# Altium schematic sheet sch.SchDoc
size A4
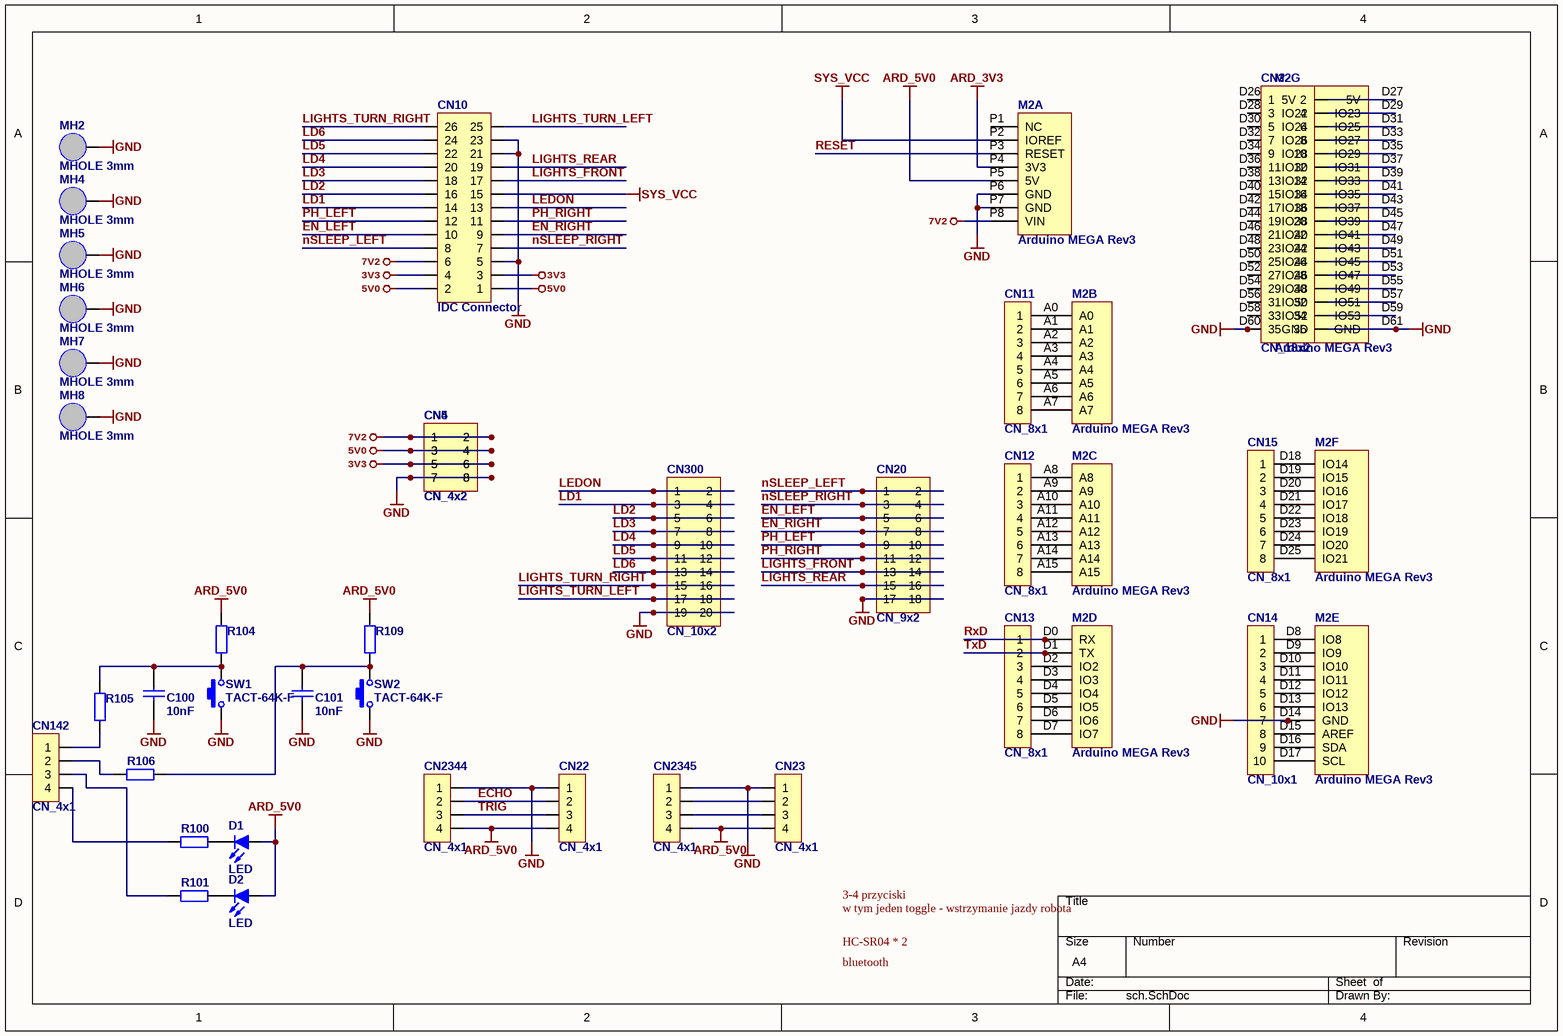
[diagram p0: sch.SchDoc]

## Parts
C100  10nF  [C0805]
C101  10nF  [C0805]
CN4  CN_4x2  [GP_4x2]
CN5  CN_4x2  [GP_4x2]
CN10  IDC Connector  [IDC26_RA]
CN11  CN_8x1  [GP_8x1]
CN12  CN_8x1  [GP_8x1]
CN13  CN_8x1  [GP_8x1]
CN14  CN_10x1  [GP_10x1]
CN15  CN_8x1  [GP_8x1]
CN20  CN_9x2  [GP_9x2]
CN22  CN_4x1  [GP_4x1H_F]
CN23  CN_4x1  [GP_4x1H_F]
CN142  CN_4x1  [GP_4x1]
CN300  CN_10x2  [GP_10x2]
CN2344  CN_4x1  [GP_4x1]
CN2345  CN_4x1  [GP_4x1]
CN?  CN_18x2  [GP_18x2]
D1  LED  [LED-Polarized - 3mm]
D2  LED  [LED-Polarized - 3mm]
M2  Arduino MEGA Rev3  [Arduino_MEGA_UPSIDE_DOWN]  (parts A,B,C,D,E,F,G of 7)
MH2  MHOLE 3mm  [3mm screw drill I]  (no BOM)
MH4  MHOLE 3mm  [3mm screw drill I]  (no BOM)
MH5  MHOLE 3mm  [3mm screw drill I]  (no BOM)
MH6  MHOLE 3mm  [3mm screw drill I]  (no BOM)
MH7  MHOLE 3mm  [3mm screw drill I]  (no BOM)
MH8  MHOLE 3mm  [3mm screw drill I]  (no BOM)
R100  (no value)  [R0805]
R101  (no value)  [R0805]
R104  (no value)  [R0805]
R105  (no value)  [R0805]
R106  (no value)  [R0805]
R109  (no value)  [R0805]
SW1  TACT-64K-F  [TACT-64K-F]
SW2  TACT-64K-F  [TACT-64K-F]

## Nets
3V3: CN4.5 CN4.6 CN5.5 CN5.6 CN10.3 CN10.4
5V0: CN4.3 CN4.4 CN5.3 CN5.4 CN10.1 CN10.2
7V2: CN4.1 CN4.2 CN5.1 CN5.2 CN10.6 M2.P8(VIN)
ARD_3V3: M2.P4(3V3)
ARD_5V0: CN22.4 CN23.4 CN2344.4 CN2345.4 D1.1(A) D2.1(A) M2.P5(5V) R104.2 R109.2
GND: C100.1 C101.1 CN4.7 CN4.8 CN5.7 CN5.8 CN10.5 CN10.21 CN10.23 CN14.7 CN20.17 CN20.18 CN22.1 CN23.1 CN300.19 CN300.20 CN2344.1 CN2345.1 CN?.35 CN?.36 M2.D14(GND) M2.D60(GND) M2.D61(GND) M2.P6(GND) M2.P7(GND) MH2.1(GND) MH4.1(GND) MH5.1(GND) MH6.1(GND) MH7.1(GND) MH8.1(GND) SW1.1 SW2.1
SYS_VCC: CN10.15 M2.P2(IOREF)
ECHO: CN22.2 CN2344.2
EN_LEFT: CN10.10 CN20.5 CN20.6
EN_RIGHT: CN10.9 CN20.7 CN20.8
LD1: CN10.14 CN300.3 CN300.4
LD2: CN10.16 CN300.5 CN300.6
LD3: CN10.18 CN300.7 CN300.8
LD4: CN10.20 CN300.9 CN300.10
LD5: CN10.22 CN300.11 CN300.12
LD6: CN10.24 CN300.13 CN300.14
LEDON: CN10.13 CN300.1 CN300.2
LIGHTS_FRONT: CN10.17 CN20.13 CN20.14
LIGHTS_REAR: CN10.19 CN20.15 CN20.16
LIGHTS_TURN_LEFT: CN10.25 CN300.17 CN300.18
LIGHTS_TURN_RIGHT: CN10.26 CN300.15 CN300.16
nSLEEP_LEFT: CN10.8 CN20.1 CN20.2
nSLEEP_RIGHT: CN10.7 CN20.3 CN20.4
PH_LEFT: CN10.12 CN20.9 CN20.10
PH_RIGHT: CN10.11 CN20.11 CN20.12
RESET: M2.P3(RESET)
RxD: CN13.1 M2.D0(RX)
TRIG: CN22.3 CN2344.3
TxD: CN13.2 M2.D1(TX)
NetC100_2: C100.2 R104.1 R105.2 SW1.2
NetC101_2: C101.2 R106.2 R109.1 SW2.2
NetCN11_1: CN11.1 M2.A0
NetCN11_2: CN11.2 M2.A1
NetCN11_3: CN11.3 M2.A2
NetCN11_4: CN11.4 M2.A3
NetCN11_5: CN11.5 M2.A4
NetCN11_6: CN11.6 M2.A5
NetCN11_7: CN11.7 M2.A6
NetCN11_8: CN11.8 M2.A7
NetCN12_1: CN12.1 M2.A8
NetCN12_2: CN12.2 M2.A9
NetCN12_3: CN12.3 M2.A10
NetCN12_4: CN12.4 M2.A11
NetCN12_5: CN12.5 M2.A12
NetCN12_6: CN12.6 M2.A13
NetCN12_7: CN12.7 M2.A14
NetCN12_8: CN12.8 M2.A15
NetCN13_3: CN13.3 M2.D2(IO2)
NetCN13_4: CN13.4 M2.D3(IO3)
NetCN13_5: CN13.5 M2.D4(IO4)
NetCN13_6: CN13.6 M2.D5(IO5)
NetCN13_7: CN13.7 M2.D6(IO6)
NetCN13_8: CN13.8 M2.D7(IO7)
NetCN14_1: CN14.1 M2.D8(IO8)
NetCN14_2: CN14.2 M2.D9(IO9)
NetCN14_3: CN14.3 M2.D10(IO10)
NetCN14_4: CN14.4 M2.D11(IO11)
NetCN14_5: CN14.5 M2.D12(IO12)
NetCN14_6: CN14.6 M2.D13(IO13)
NetCN14_8: CN14.8 M2.D15(AREF)
NetCN14_9: CN14.9 M2.D16(SDA)
NetCN14_10: CN14.10 M2.D17(SCL)
NetCN15_1: CN15.1 M2.D18(IO14)
NetCN15_2: CN15.2 M2.D19(IO15)
NetCN15_3: CN15.3 M2.D20(IO16)
NetCN15_4: CN15.4 M2.D21(IO17)
NetCN15_5: CN15.5 M2.D22(IO18)
NetCN15_6: CN15.6 M2.D23(IO19)
NetCN15_7: CN15.7 M2.D24(IO20)
NetCN15_8: CN15.8 M2.D25(IO21)
NetCN23_2: CN23.2 CN2345.2
NetCN23_3: CN23.3 CN2345.3
NetCN142_1: CN142.1 R105.1
NetCN142_2: CN142.2 R106.1
NetCN142_3: CN142.3 R101.1
NetCN142_4: CN142.4 R100.1
NetCN?_1: CN?.1 M2.D26(5V)
NetCN?_2: CN?.2 M2.D27(5V)
NetCN?_3: CN?.3 M2.D28(IO22)
NetCN?_4: CN?.4 M2.D29(IO23)
NetCN?_5: CN?.5 M2.D30(IO24)
NetCN?_6: CN?.6 M2.D31(IO25)
NetCN?_7: CN?.7 M2.D32(IO26)
NetCN?_8: CN?.8 M2.D33(IO27)
NetCN?_9: CN?.9 M2.D34(IO28)
NetCN?_10: CN?.10 M2.D35(IO29)
NetCN?_11: CN?.11 M2.D36(IO30)
NetCN?_12: CN?.12 M2.D37(IO31)
NetCN?_13: CN?.13 M2.D38(IO32)
NetCN?_14: CN?.14 M2.D39(IO33)
NetCN?_15: CN?.15 M2.D40(IO34)
NetCN?_16: CN?.16 M2.D41(IO35)
NetCN?_17: CN?.17 M2.D42(IO36)
NetCN?_18: CN?.18 M2.D43(IO37)
NetCN?_19: CN?.19 M2.D44(IO38)
NetCN?_20: CN?.20 M2.D45(IO39)
NetCN?_21: CN?.21 M2.D46(IO40)
NetCN?_22: CN?.22 M2.D47(IO41)
NetCN?_23: CN?.23 M2.D48(IO42)
NetCN?_24: CN?.24 M2.D49(IO43)
NetCN?_25: CN?.25 M2.D50(IO44)
NetCN?_26: CN?.26 M2.D51(IO45)
NetCN?_27: CN?.27 M2.D52(IO46)
NetCN?_28: CN?.28 M2.D53(IO47)
NetCN?_29: CN?.29 M2.D54(IO48)
NetCN?_30: CN?.30 M2.D55(IO49)
NetCN?_31: CN?.31 M2.D56(IO50)
NetCN?_32: CN?.32 M2.D57(IO51)
NetCN?_33: CN?.33 M2.D58(IO52)
NetCN?_34: CN?.34 M2.D59(IO53)
NetD1_2: D1.2(K) R100.2
NetD2_2: D2.2(K) R101.2

Not connected (* = marked no-connect by the designer): M2 P1(NC)

## Notes on the sheet
- Labels drawn without touching a wire or pin: 3-4 przyciski, bluetooth, HC-SR04 * 2, w tym jeden toggle - wstrzymanie jazdy robota

## Library data of the parts
C100 C101 = Cap: Capacitor; ComponentLink1Description: datasheet; ComponentLink2Description: supplier; Value: 10nF
CN10 = CN_13x2
D1 D2 = LED: Typical RED, GREEN, YELLOW, AMBER GaAs LED; Published: 04-Apr-2006
M2 = Arduino MEGA Rev3: Arduino MEGA Rev3 Board
MH2 MH4-MH8 = MHOLE_3MM: 3mm Mounting Hole
R100 R101 R104-R106 R109 = Res: Resistor; Published: 19-Feb-2006; ComponentLink1Description: datasheet; ComponentLink2Description: supplier
SW1 SW2 = TACT-64K-F: 6x6mm THT Tactile SPST-NO Switch; Published: 30-Jun-2006